# EAGLE schematic 1uprava4 (EAGLE 9.5.2)
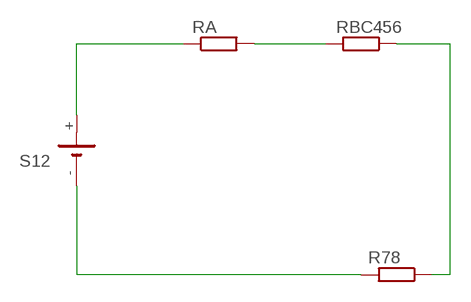
[diagram p0: schematic, sheet 1]

## Parts
R78  355R  R-EU_0204/7  [0204/7]
RA  680R  R-EU_0204/7  [0204/7]
RBC456  260R  R-EU_0204/7  [0204/7]
S12  135V  CH291-1220LF  [CH291-1220LF]

## Nets
N$1: RA.1 S12.+
N$2: RA.2 RBC456.2
N$6: R78.1 RBC456.1
N$7: R78.2 S12.-

## Library data of the parts
R78 RA RBC456 = rcl:R-EU_: RESISTOR, European symbol; SPICEPREFIX: R
S12 = battery:CH291-1220LF: Battery Holder, SMT, 12mm multicomp PART NO. CH291-1220LF Source: Data sheet <http://www.farnell.com/datasheets/1505860.pdf>